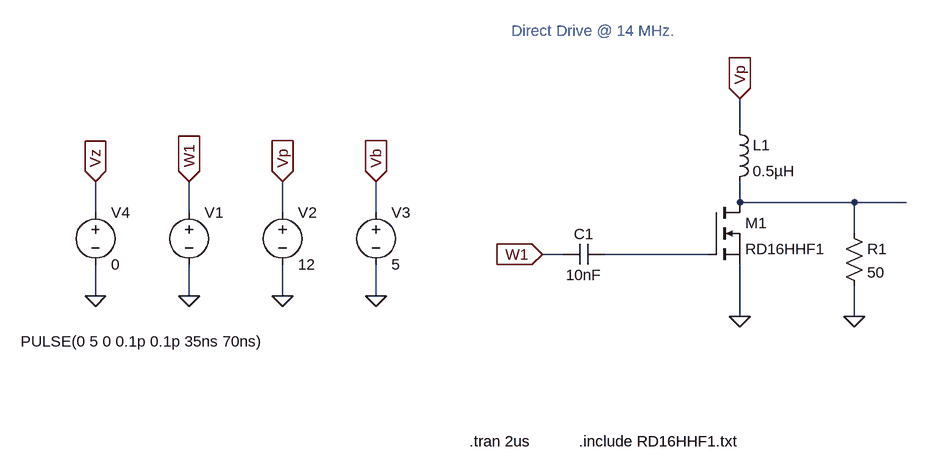
[diagram p0: schematic HF-PA-v1-Simulation-14-MHz-v8-Direct-RD16HHF1.asc]
HF-PA-v1-Simulation-14-MHz-v8-Direct-RD16HHF1.asc, the LTspice schematic file:
Version 4
SHEET 1 1044 680
WIRE 256 -144 256 -192
WIRE 256 -32 256 -64
WIRE 432 -32 256 -32
WIRE 512 -32 432 -32
WIRE -736 -16 -736 -64
WIRE -592 -16 -592 -64
WIRE -448 -16 -448 -64
WIRE -304 -16 -304 -64
WIRE 256 -16 256 -32
WIRE 432 16 432 -32
WIRE -16 48 -48 48
WIRE 208 48 48 48
WIRE -736 112 -736 64
WIRE -592 112 -592 64
WIRE -448 112 -448 64
WIRE -304 112 -304 64
WIRE 256 144 256 64
WIRE 432 144 432 96
FLAG -48 48 W1
IOPIN -48 48 In
FLAG 256 -192 Vp
IOPIN 256 -192 In
FLAG -592 112 0
FLAG -448 112 0
FLAG -592 -64 W1
IOPIN -592 -64 In
FLAG -448 -64 Vp
IOPIN -448 -64 In
FLAG 256 144 0
FLAG -304 112 0
FLAG -304 -64 Vb
IOPIN -304 -64 In
FLAG -736 -64 Vz
IOPIN -736 -64 In
FLAG -736 112 0
FLAG 432 144 0
SYMBOL voltage -592 -32 R0
WINDOW 3 -259 214 Left 2
WINDOW 123 0 0 Left 0
WINDOW 39 0 0 Left 0
SYMATTR Value PULSE(0 5 0 0.1p 0.1p 35ns 70ns)
SYMATTR InstName V1
SYMBOL voltage -448 -32 R0
WINDOW 123 0 0 Left 0
WINDOW 39 0 0 Left 0
SYMATTR InstName V2
SYMATTR Value 12
SYMBOL voltage -304 -32 R0
WINDOW 123 0 0 Left 0
WINDOW 39 0 0 Left 0
SYMATTR InstName V3
SYMATTR Value 5
SYMBOL cap 48 32 R90
WINDOW 0 0 32 VBottom 2
WINDOW 3 32 32 VTop 2
SYMATTR InstName C1
SYMATTR Value 10nF
SYMBOL ind 240 -160 R0
SYMATTR InstName L1
SYMATTR Value 0.5µH
SYMBOL voltage -736 -32 R0
WINDOW 123 0 0 Left 0
WINDOW 39 0 0 Left 0
SYMATTR InstName V4
SYMATTR Value 0
SYMBOL nmos 208 -32 R0
SYMATTR InstName M1
SYMATTR Value RD16HHF1
SYMBOL res 416 0 R0
SYMATTR InstName R1
SYMATTR Value 50
TEXT -160 336 Left 2 !.tran 2us
TEXT 8 336 Left 2 !.include RD16HHF1.txt
TEXT -96 -296 Left 2 ;Direct Drive @ 14 MHz.

The netlist it stands for:
* HF-PA-v1-Simulation-14-MHz-v8-Direct-RD16HHF1.asc
V1 W1 0 PULSE(0 5 0 0.1p 0.1p 35ns 70ns)
V2 Vp 0 12
V3 Vb 0 5
C1 N002 W1 10nF
L1 Vp N001 0.5µH
V4 Vz 0 0
M1 N001 N002 0 0 RD16HHF1
R1 N001 0 50
.model NMOS NMOS
.model PMOS PMOS
.lib standard.mos
.tran 2us
.include RD16HHF1.txt
* Direct Drive @ 14 MHz.
.backanno
.end